# Altium schematic sheet DFN1X1.SchDoc
size A4; SheetNumber: 10; SheetTotal: 16
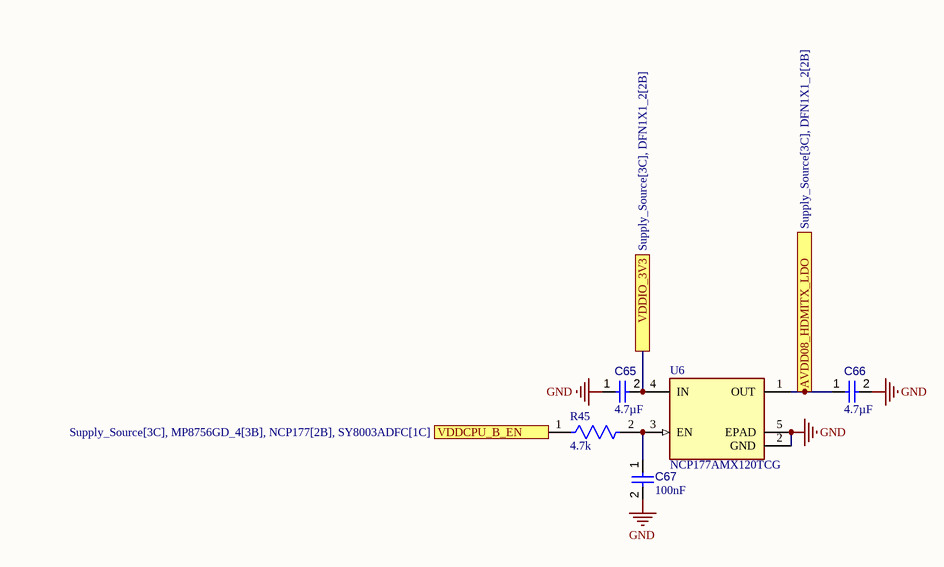
[diagram p0: DFN1X1.SchDoc]

## Parts
C65  value 4.7µF  [CAPC0603(1608)100_L]  (hidden comment: Capacitor 4.7µF +/-20% 10V 0603)
C66  value 4.7µF  [CAPC0603(1608)100_L]  (hidden comment: Capacitor 4.7µF +/-20% 10V 0603)
C67  value 100nF  [CAPC1005X56X25LL10T15]  (hidden comment: Capacitor 0.1 uF +/- 5% 16 V 0402)
R45  value 4.7k  [FP-RMCF0201-IPC_A]  (hidden comment: RMCF0201JT4K70)
U6  NCP177AMX120TCG  [FP-711AJ-MFG]

## Ports
AVDD08_HDMITX_LDO (see Supply_Source[3C], DFN1X1_2[2B]), VDDCPU_B_EN (see Supply_Source[3C], MP8756GD_4[3B], NCP177[2B], SY8003ADFC[1C]), VDDIO_3V3 (see Supply_Source[3C], DFN1X1_2[2B])

## Nets
GND: C65.1 C66.2 C67.2 U6.2(GND) U6.5(EPAD)
AVDD08_HDMITX_LDO: C66.1 U6.1(OUT) ; port AVDD08_HDMITX_LDO
VDDCPU_B_EN: R45.1 ; port VDDCPU_B_EN
VDDIO_3V3: C65.2 U6.4(IN) ; port VDDIO_3V3
NetC67_1: C67.1 R45.2 U6.3(EN)

## Library data of the parts
C65 C66 = CMP-001-00076-4: Chip Capacitor, 4.7µF +/-20%, 10V, 0603, Thickness 1 mm; Tolerance: 10%; Mounting Technology: SMT; Case/Package: 0603; Pins: 2; Min Operating Temperature: -55°C; Max Operating Temperature: 85°C; Voltage Rating: 10V
C67 = CMP-001-00001-6: Chip Capacitor, 0.1 uF, +/- 5%, 16 V, 0402 (1005 Metric); Capacitor Type: Ceramic; Voltage Rating: 16V; Max Operating Temperature: 125°C; Min Operating Temperature: -55°C; Case/Package: 0402; Mounting Technology: SM; Pins: 2; Tolerance: 5%; RoHS Compliant: True
R45 = CMP-009-00207-1: Res Thick Film 0201 4.7K Ohm 5% 0.05W(1/20W) ±200ppm/C Pad SMD Automotive T/R; Voltage Rating: 25V; Case/Package: 0201; Tolerance: 5%; Mounting Technology: Surface Mount; Min Operating Temperature: -55°C; Max Operating Temperature: 155°C
U6 = CMP-07128-000002-1: IC REG LINEAR 1.2V 500MA 4XDFN; Manufacturer: ON Semiconductor; Dropout Voltage: 295mV; Max Supply Voltage: 5.5V; Nominal Supply Current: 60uA; Accuracy Percentage: 1.2%; Output Type: Fixed; Standoff Height: 0mm; Min Supply Voltage: 1.6V; Max Junction Temp: +150°C; Number Of Outputs: 1; Output Current: 500mA; ComponentLink2Description: Datasheet; Temperature: to +150°C; Category: IC; Device Class L3: Voltage Regulators - Linear; Manufacturer Part Number: NCP177AMX120TCG; RoHS: TRUE; Lead Free: Yes; Octopart: https://octopart.com/ncp177amx120tcg-on+semiconductor-67320276; Device Class L1: Integrated Circuits (ICs); Mouser Description: LDO Voltage Regulators FAST TRANSIENT RESPO; Digikey Description: IC REG LINEAR 1.2V 500MA 4XDFN; ComponentLink2URL: https://www.onsemi.com/pub/Collateral/NCP177-D.PDF; Output Voltage: 1.2V; Device Class L2: Power Management ICs; Package: 711AJ; Height: 0.43mm; Automotive: No; Footprint Url: https://www.onsemi.com/pub/Collateral/711AJ.PDF; Temperature Range High: +150°C